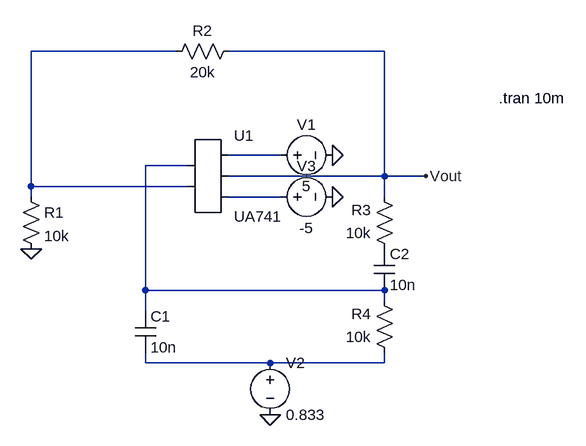
[diagram p0: schematic Draft1.asc]
Draft1.asc, the LTspice schematic file:
Version 4
SHEET 1 1008 704
WIRE 400 128 176 128
WIRE 720 128 480 128
WIRE 560 288 480 288
WIRE 416 304 352 304
WIRE 720 320 720 128
WIRE 720 320 480 320
WIRE 784 320 720 320
WIRE 176 336 176 128
WIRE 416 336 176 336
WIRE 176 352 176 336
WIRE 560 352 480 352
WIRE 720 352 720 320
WIRE 352 496 352 304
WIRE 720 496 352 496
WIRE 720 512 720 496
WIRE 352 528 352 496
WIRE 352 608 352 592
WIRE 544 608 352 608
WIRE 720 608 720 592
WIRE 720 608 544 608
FLAG 784 320 Vout
FLAG 640 288 0
FLAG 176 432 0
FLAG 544 688 0
FLAG 640 352 0
SYMBOL AutoGenerated/UA741 448 320 R0
SYMATTR InstName U1
SYMBOL res 160 336 R0
SYMATTR InstName R1
SYMATTR Value 10k
SYMBOL res 496 112 R90
WINDOW 0 0 56 VBottom 2
WINDOW 3 32 56 VTop 2
SYMATTR InstName R2
SYMATTR Value 20k
SYMBOL res 736 448 R180
WINDOW 0 36 76 Left 2
WINDOW 3 36 40 Left 2
SYMATTR InstName R3
SYMATTR Value 10k
SYMBOL res 736 608 R180
WINDOW 0 36 76 Left 2
WINDOW 3 36 40 Left 2
SYMATTR InstName R4
SYMATTR Value 10k
SYMBOL cap 336 528 R0
SYMATTR InstName C1
SYMATTR Value 10n
SYMBOL cap 704 432 R0
SYMATTR InstName C2
SYMATTR Value 10n
SYMBOL voltage 544 288 R270
WINDOW 0 32 56 VTop 2
WINDOW 3 -32 56 VBottom 2
SYMATTR InstName V1
SYMATTR Value 5
SYMBOL voltage 544 592 R0
SYMATTR InstName V2
SYMATTR Value 0.833
SYMBOL voltage 544 352 M90
WINDOW 0 -32 56 VBottom 2
WINDOW 3 32 56 VTop 2
SYMATTR InstName V3
SYMATTR Value -5
TEXT 896 200 Left 2 !.tran 10m

The netlist it stands for:
* Draft1.asc
* U1: UA741 (symbol AutoGenerated/UA741 not available, pins judged from their places): pin1=N003 pin2=N001 pin3=N002 pin4=Vout pin5=N004
R1 N001 0 10k
R2 Vout N001 20k
R3 P001 Vout 10k
R4 N005 N003 10k
C1 N003 N005 10n
C2 P001 N003 10n
V1 N002 0 5
V2 N005 0 0.833
V3 N004 0 -5
.tran 10m
.backanno
.end